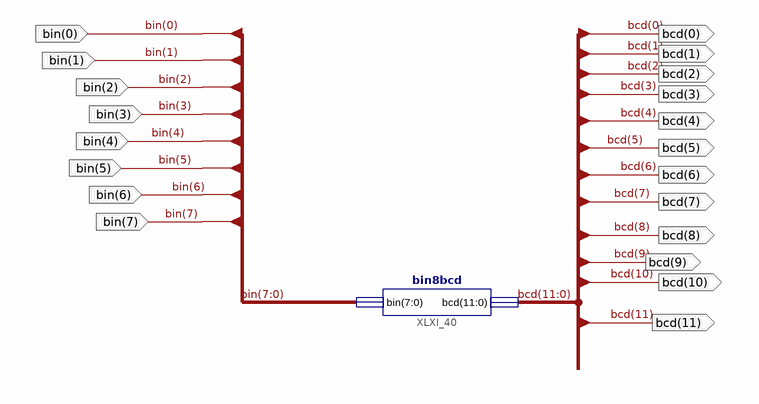
[diagram p0: schematic sheet 1]
// Xilinx ISE schematic mainRX.sch (spartan6) as structural Verilog: 1 symbols, 20 ports
module mainRX (
  input  [7:0] bin,
  output [11:0] bcd
);

  bin8bcd XLXI_40 (.bin(bin), .bcd(bcd));
endmodule
